# Altium project Camera.PrjPcb
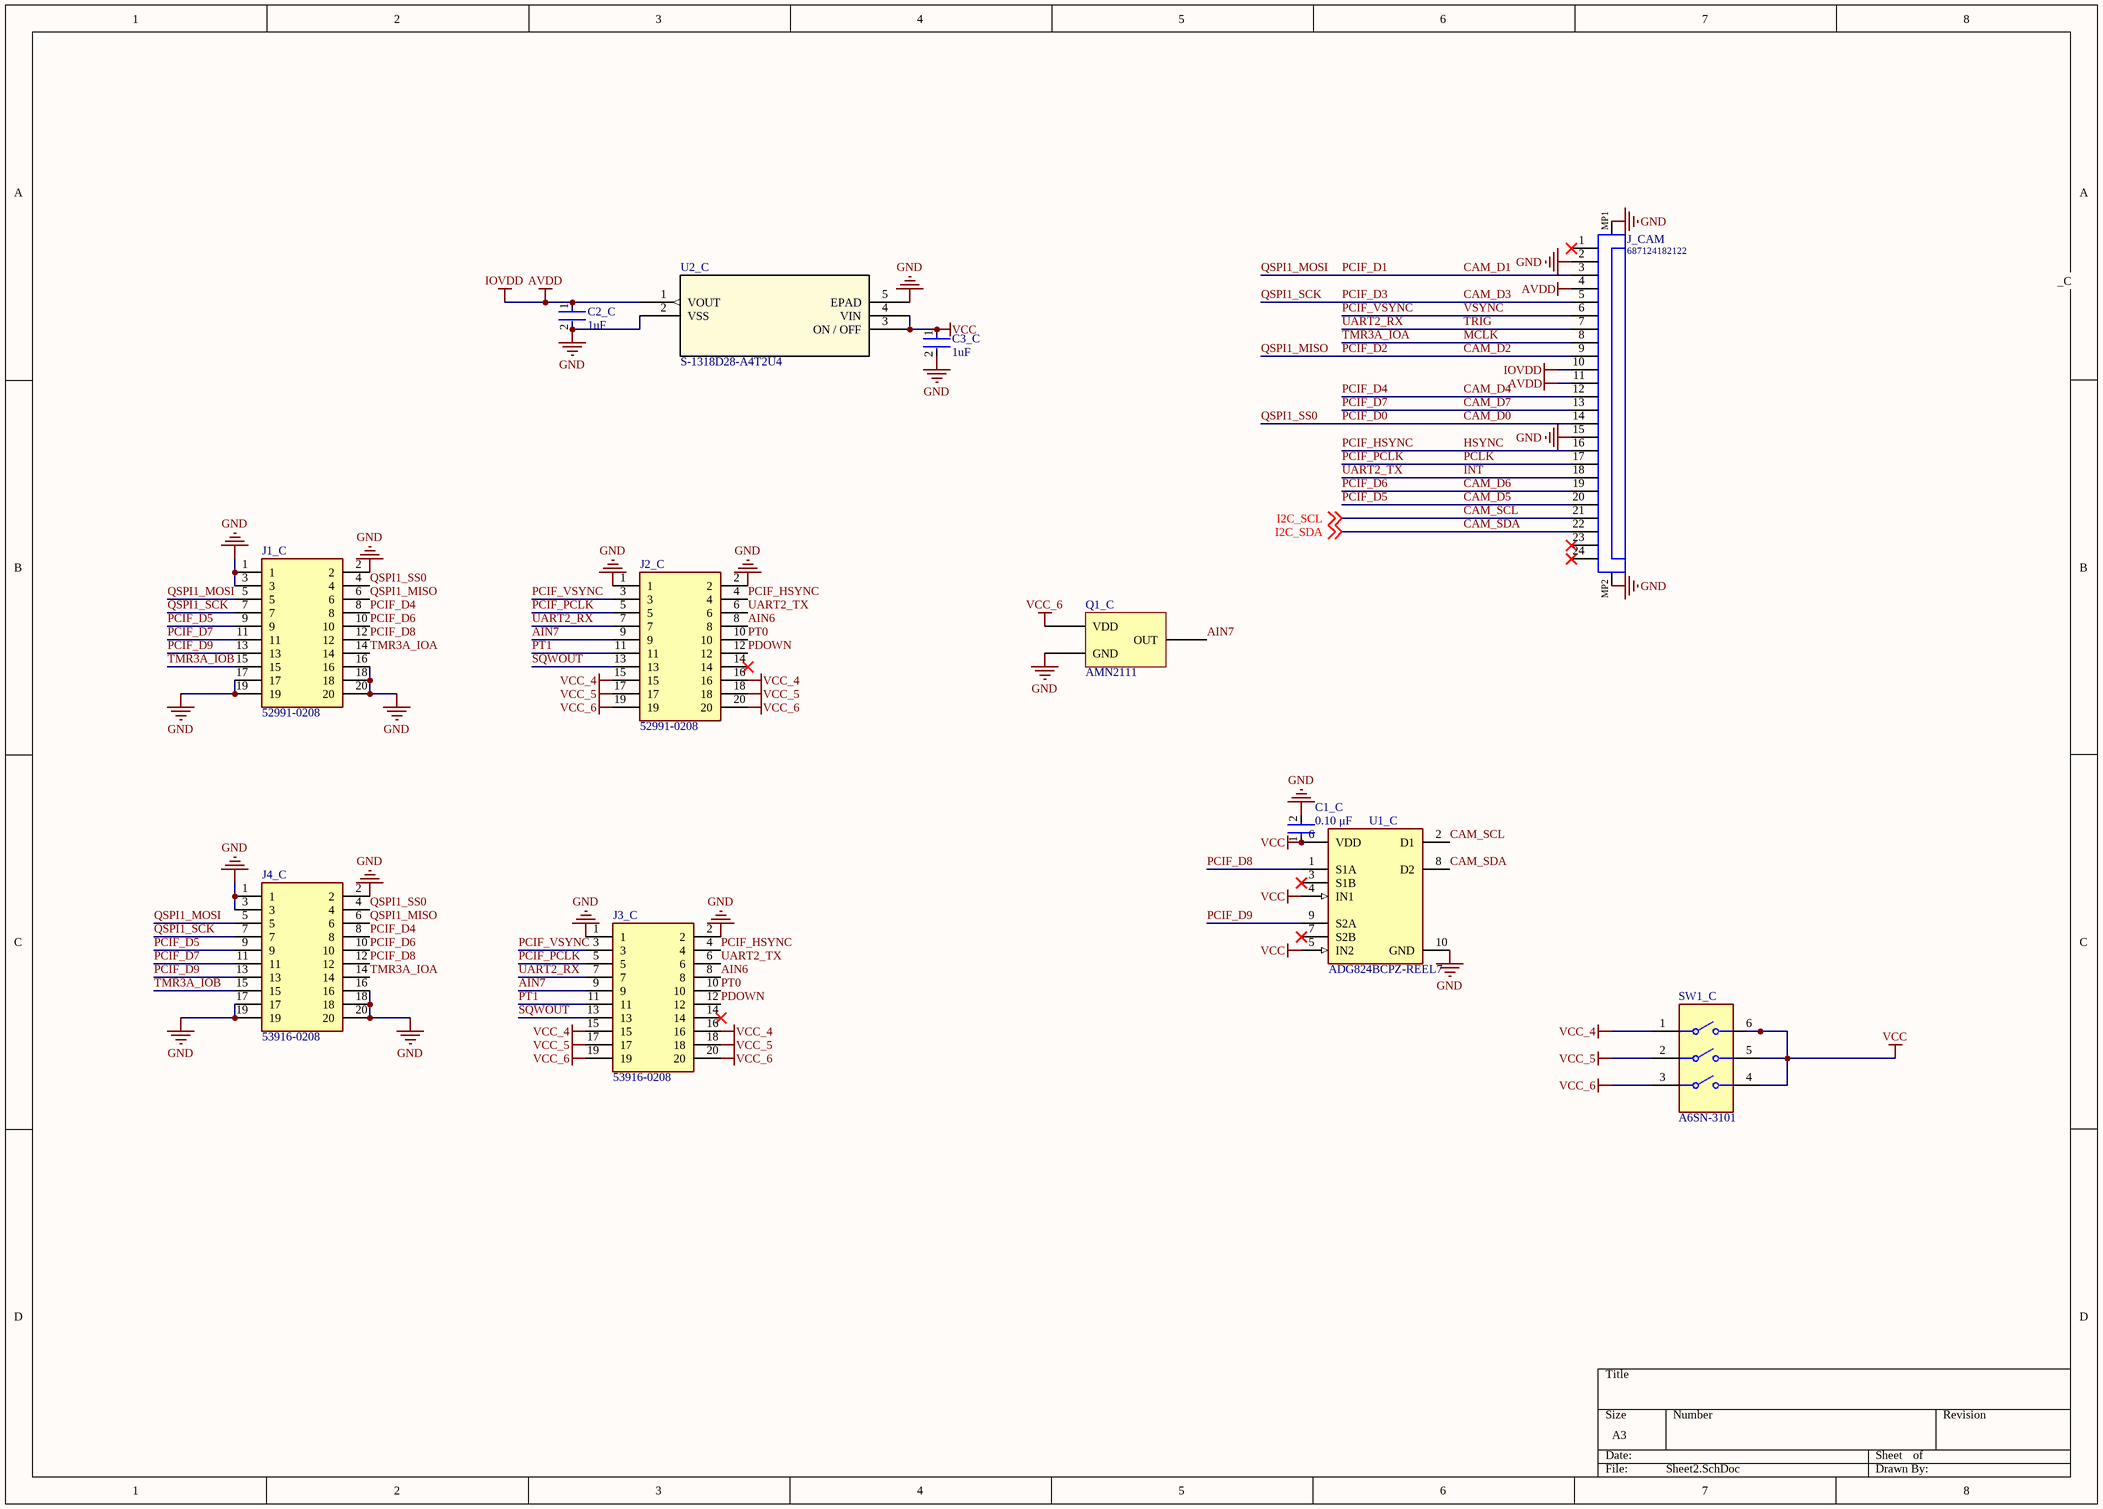
[diagram p0: Sheet2.SchDoc]
1 sheet, 12 parts. Net scope: global (net labels, ports and power ports of the same name join across sheets).
Board file: PCB3.PcbDoc

## Sheet Sheet2.SchDoc
size A3; SheetNumber: 1; SheetTotal: 1; SPICEModelCacheLDHLSTWD: <root> / <DocumentId>LDHLSTWD</DocumentId> / <CacheFrame Number="0"> / <Model Name="umk107bj105_a-t" Kind="CKT"> / <Text>* UMK107BJ105_A-T     SPICE MODEL  ( General Type ) / *-------------------------------------------------------------------------------------------------------- / * Model Generated by TAIYO YUDEN Corporation (http://www.ty-top.com) / * Version 1.0 / * TAIYO YUDEN Control No. 170508_130520 / * Copyright(c) 2012 TAIYO YUDEN CO.,LTD. All Rights Reserved. / *-------------------------------------------------------------------------------------------------------- / * / * Products Name : Multilayer Ceramic Capacitors / * / * Characteristics : / *     Capacitance : 1 uF , Rated Voltage : 50V , TCC : X5R / *     Case Size : 1.6 x 0.8 / 0.063 x 0.031 [mm/inch] , Thickness : 0.8 / 0.031 [mm/inch] / *     (Conditions: Temperature = 25 degC , DC Bias Current/Voltage = 0A / 0V) / * / * Frequency Range : 40Hz - 3GHz / * / * External Node Assignments : / * / *  1  o---| |---o  2 / * / *-------------------------------------------------------------------------------------------------------- / .SubCkt UMK107BJ105_A-T 1 2 / **************************** / C0 1 110 0.79929u / Cm 1 101 0.13681u / C1 101 102 0.26224u / Rc1 101 102 5.8806k / C2 102 103 0.057839u / Rc2 102 103 469.42 / C3 103 110 0.014568u / Rc3 103 110 14.853 / C2m 1 301 0.13283u / C21 301 302 1.2593u / Rc21 301 302 6.3079k / C22 302 303 1.1189u / Rc22 302 303 6.9405k / C23 303 304 1.1421u / Rc23 303 304 6.4848k / C24 304 305 0.36861u / Rc24 304 305 785 / C25 305 306 0.39327u / Rc25 305 306 637.41 / C26 306 307 0.27451u / Rc26 306 307 19.365 / C27 307 308 0.15295u / Rc27 307 308 23.239 / C28 308 309 0.17569u / Rc28 308 309 17.788 / C29 309 110 1420.6p / Rc29 309 110 1.9725 / Rp0 1 110 500Meg / L0 110 120 0.24088n / Lm 120 130 0.1369n / L1 120 121 0.1842n / RL1 121 130 0.29804 / L2 120 122 0.40657n / RL2 122 130 0.57395 / L3 120 123 0.85773n / RL3 123 130 0.82282 / CR 120 124 0.11463u / LR 124 125 0.25983n / RR 125 130 52.447m / CL 130 140 1.4637p / LL 130 140 0.23986n / RL 130 140 33.985 / Rs 140 2 6.8539m / **************************** / .ends UMK107BJ105_A-T</Text> / </Model> / </CacheFrame> / </root>

### Parts
C1_C  Capacitance: 0.10 μF  [FP-C0402-BB-MFG]  (hidden comment: C0402C104K8PACTU)
C2_C  Capacitance: 1uF  [FP-0603-L_1_6_0_1-W_0_8_0-IPC_A]  (hidden comment: UMK107BJ105KA-T)
C3_C  Capacitance: 1uF  [FP-0603-L_1_6_0_1-W_0_8_0-IPC_A]  (hidden comment: UMK107BJ105KA-T)
J1_C  52991-0208  [MOLEX_52991-0208]
J2_C  52991-0208  [MOLEX_52991-0208]
J3_C  53916-0208  [MOLEX-  539160208]
J4_C  53916-0208  [MOLEX-  539160208]
J_CAM  687124182122  [687124182122]
Q1_C  AMN2111  [AMN21111]
SW1_C  A6SN-3101  [FP-A6SN-3101-MFG]
U1_C  ADG824BCPZ-REEL7  [FP-CP-10-10-MFG]
U2_C  S-1318D28-A4T2U4  [SMD04_HSNT_1X1_ABL]

### Nets
AVDD: C2_C.1 J_CAM.4 J_CAM.10 J_CAM.11 U2_C.1(VOUT)  [also labelled IOVDD]
GND: C1_C.2 C2_C.2 C3_C.2 J1_C.1 J1_C.2 J1_C.3 J1_C.16 J1_C.17 J1_C.18 J1_C.19 J1_C.20 J2_C.1 J2_C.2 J3_C.1 J3_C.2 J4_C.1 J4_C.2 J4_C.3 J4_C.16 J4_C.17 J4_C.18 J4_C.19 J4_C.20 J_CAM.2 J_CAM.15 J_CAM.MP1 J_CAM.MP2 Q1_C.2(GND) U1_C.10(GND) U2_C.2(VSS) U2_C.5(EPAD)
VCC: C1_C.1 C3_C.1 SW1_C.4 SW1_C.5 SW1_C.6 U1_C.4(IN1) U1_C.5(IN2) U1_C.6(VDD) U2_C.3(ON_/_OFF) U2_C.4(VIN)
VCC_4: J2_C.15 J2_C.16 J3_C.15 J3_C.16 SW1_C.1
VCC_5: J2_C.17 J2_C.18 J3_C.17 J3_C.18 SW1_C.2
VCC_6: J2_C.19 J2_C.20 J3_C.19 J3_C.20 Q1_C.1(VDD) SW1_C.3
AIN6: J2_C.8 J3_C.8
AIN7: J2_C.9 J3_C.9 Q1_C.3(OUT)
CAM_D0: J1_C.4 J4_C.4 J_CAM.14  [also labelled PCIF_D0, QSPI1_SS0]
CAM_D1: J1_C.5 J4_C.5 J_CAM.3  [also labelled PCIF_D1, QSPI1_MOSI]
CAM_D2: J1_C.6 J4_C.6 J_CAM.9  [also labelled PCIF_D2, QSPI1_MISO]
CAM_D3: J1_C.7 J4_C.7 J_CAM.5  [also labelled PCIF_D3, QSPI1_SCK]
CAM_D4: J1_C.8 J4_C.8 J_CAM.12  [also labelled PCIF_D4]
CAM_D5: J1_C.9 J4_C.9 J_CAM.20  [also labelled PCIF_D5]
CAM_D6: J1_C.10 J4_C.10 J_CAM.19  [also labelled PCIF_D6]
CAM_D7: J1_C.11 J4_C.11 J_CAM.13  [also labelled PCIF_D7]
CAM_SCL: J_CAM.21 U1_C.2(D1) ; off-sheet I2C_SCL  [also labelled I2C_SCL]
CAM_SDA: J_CAM.22 U1_C.8(D2) ; off-sheet I2C_SDA  [also labelled I2C_SDA]
HSYNC: J2_C.4 J3_C.4 J_CAM.16  [also labelled PCIF_HSYNC]
INT: J2_C.6 J3_C.6 J_CAM.18  [also labelled UART2_TX]
MCLK: J1_C.14 J4_C.14 J_CAM.8  [also labelled TMR3A_IOA]
PCIF_D8: J1_C.12 J4_C.12 U1_C.1(S1A)
PCIF_D9: J1_C.13 J4_C.13 U1_C.9(S2A)
PCIF_PCLK: J2_C.5 J3_C.5 J_CAM.17  [also labelled PCLK]
PCIF_VSYNC: J2_C.3 J3_C.3 J_CAM.6  [also labelled VSYNC]
PDOWN: J2_C.12 J3_C.12
PT0: J2_C.10 J3_C.10
PT1: J2_C.11 J3_C.11
SQWOUT: J2_C.13 J3_C.13
TMR3A_IOB: J1_C.15 J4_C.15
TRIG: J2_C.7 J3_C.7 J_CAM.7  [also labelled UART2_RX]

Not connected (* = marked no-connect by the designer): J2_C 14*; J3_C 14*; J_CAM 1* 23* 24*; U1_C 3(S1B)* 7(S2B)*

### Notes on the sheet
- _C

### Library data of the parts
C1_C = CMP-2008-02046-2: CAP CER 0.1UF 10V X5R 0402; Manufacturer: Kemet; Material: Ceramic; Temperature Coefficient: 15%; Tolerance: 0.1; Value: 0.10 μF; Package: C0402-BB; Temperature: -55°C to +125°C; ComponentLink2Description: Datasheet; Temperature Characteristic: X5R; Device Class L1: Passive Components; Height: 0.55mm; Lead Free: Yes; ComponentLink2URL: https://content.kemet.com/datasheets/KEM_C1002_X7R_SMD.pdf; Device Class L2: Capacitors; Temperature Range Low: -55°C; Temperature Range High: +125°C; RoHS: TRUE; Octopart: https://octopart.com/c0402c104k8pactu-kemet-140039; Automotive: No; Mouser Description: Capacitor 100 nF 10 VDC 0402; Category: Cap; Voltage Rating: 10 V; Digikey Description: CAP CER 0.1UF 10V X5R 0402; Ipc Land Pattern Name: CAPC10050X50; Device Class L3: Ceramic Capacitors; Manufacturer Part Number: C0402C104K8PACTU
C2_C C3_C = CMP-2000-05447-3: None; Tolerance: 10%; Voltage Rating: 50V; Dielectric: X5R; Height: 0.8mm; Depth: 0.8mm; Number of Pins: 2; Length: 1.6mm; Thickness: 0.035inch; Contact Plating: Nickel; Radiation Hardening: No; Package Quantity: 1; Case/Package: 0603; Halogen Free: Halogen Free; RoHS Compliant: Yes; Termination: SMD/SMT; Max Operating Temperature: 85°C; Min Operating Temperature: -55°C; Case Code (Metric): 1608; Construction: Flat; Voltage Rating (DC): 50V; Packaging: Tape and Reel; Series: M; Case Code (Imperial): 0603; Width: 0.031inch; Mount: Surface Mount
J1_C J2_C = 52991-0208: 20 Position Connector Receptacle, Center Strip Contacts Surface Mount Gold; MF: Molex; SnapEDA_Link: https://www.snapeda.com/parts/52991-0208/Molex/view-part/230631/?ref=snap; Availability: Unavailable; MP: 52991-0208; Price: None; Package: None; Value: *
J_CAM = CMP-1502-01655-1: SMT ZIF Connectors WR-FPC, Horizontal, Back Locking Dual Contact, pitch 0.5 mm, 24 pins; Manufacturer: Wurth Elektronik; Pitch: 0.5mm; Pin Number: 24; Rated Current: 0.5A; Withstanding Voltage: 250VAC; Working Voltage: 50VAC; Contact Resistance: 30mOhm; Datasheet URL: https://katalog.we-online.de/em/datasheet/687124182122.pdf; Packaging: TapeandReel; Part Number: 687124182122; Mounting Technology: SMT; Publisher: WurthElektronik; Package Reference: 687124182122; Operating Temperature: -55to85degC; Contact Design: BackLockingDualContact; Manufacturer URL: http://www.we-online.de; Orientation: Horizontal
SW1_C = CMP-08827-000007-1: SWITCH SLIDE DIP SPST 25MA 24V; Manufacturer: Omron Electronics Inc-EMC Div; Electromechanical Life: 1000Cycles; Contact Resistance: 200mΩ; Standoff Height: 0.7mm; Number Of Circuits: 3; Device Class L2: Switches; Device Class L3: DIP Switches; Ambient Temperature Range High: +85°C; RoHS: TRUE; Temperature Range High: +85°C; Ambient Temperature Range Low: -30°C; ComponentLink2URL: https://omronfs.omron.com/en_US/ecb/products/pdf/en-a6sn.pdf; Category: Switch; Temperature Range Low: -30°C; Digikey Description: SWITCH SLIDE DIP SPST 25MA 24V; Package: A6SN-3101; Mouser Description: DIP Switches / SIP Switches 3P Knife-Edge, 2.3mm Slide SMT Flat-Act; Device Class L1: Electromechanical; Current Rating: 25mA; Lead Free: Yes; ComponentLink2Description: Datasheet; Throw Configuration: SPST; Voltage Rating Dc: 24V; Height: 4.55mm; Octopart: https://octopart.com/a6sn-3101-omron-55396000; Automotive: No; Manufacturer Part Number: A6SN-3101; Temperature: -30°C to +85°C
U1_C = CMP-09113-000012-1: IC SWITCH DUAL SPDT 10LFCSP; Manufacturer: Analog Devices; Nominal Supply Current: 0.003uA; Max Supply Voltage: 3.6V; Interface: LVCMOS; On State Resistance: 0.5Ω; -3Db Bandwith: 90MHz; Number Of Circuits: 2; Mux Demux Ratio: 1:2; Standoff Height: 0.02mm; Min Supply Voltage: 1.65V; Temperature: -40°C to +85°C; ComponentLink2URL: https://www.analog.com/media/en/technical-documentation/data-sheets/ADG824.pdf; Device Class L2: Interface ICs; Octopart: https://octopart.com/adg824bcpz-reel7-analog+devices-12410880; Temperature Range High: +85°C; Manufacturer Part Number: ADG824BCPZ-REEL7; Lead Free: Yes; Temperature Range Low: -40°C; ComponentLink2Description: Datasheet; Footprint Url: https://www.analog.com/media/en/symbols-footprints/symbols/ADG824BCPZ-REEL7.bxl; RoHS: TRUE; Device Class L3: Analog Switches; Device Class L1: Integrated Circuits (ICs); Automotive: No; Height: 0.6mm; Package: CP-10-10; Throw Configuration: SPDT; Category: IC; Digikey Description: IC SWITCH DUAL SPDT 10LFCSP
U2_C = S-1318D28-A4T2U4: No Description Available; Mfr_Name: ABLIC; Copyright: Copyright (C) 2022 Ultra Librarian. All rights reserved.; Manufacturer_Part_Number: S-1318D28-A4T2U4; Digi-Key_Part_Number_1: 1662-S-1318D28-A4T2U4TR-ND; Digi-Key_Part_Number_2: 1662-S-1318D28-A4T2U4CT-ND; Digi-Key_Part_Number_3: 1662-S-1318D28-A4T2U4DKR-ND; RefDes: RefDes; Type: DEV